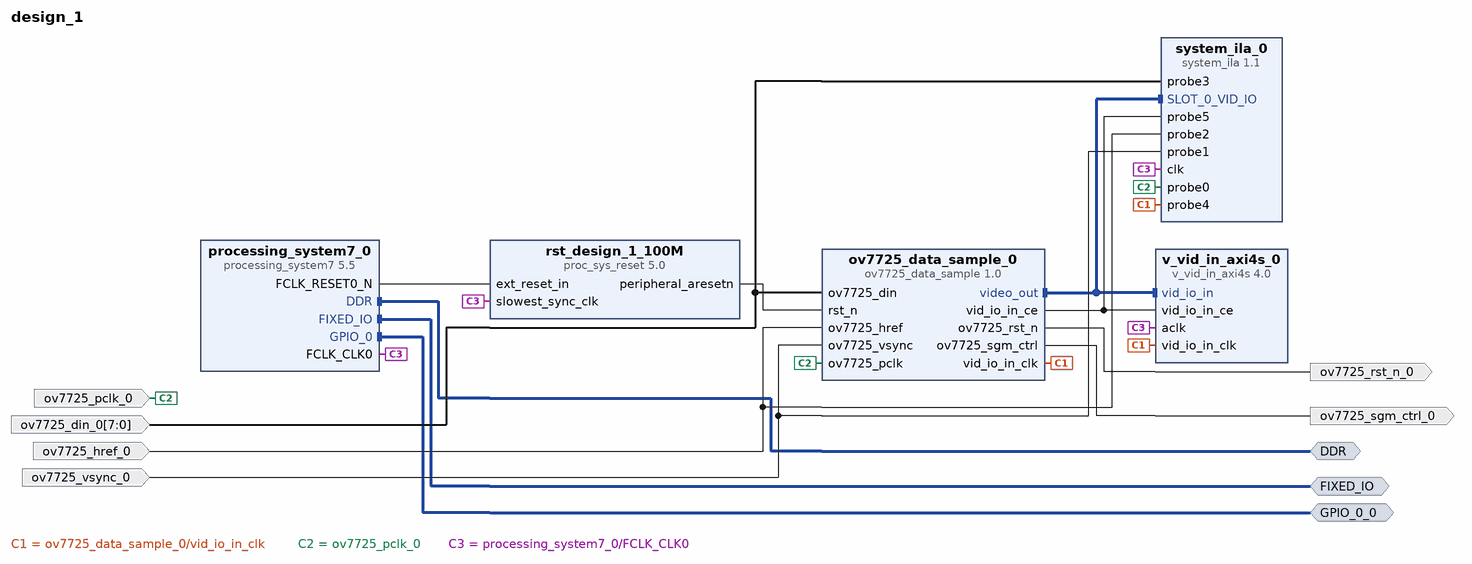
[diagram p0: block diagram of the top level]
# Vivado block design design_1, xc7z010clg400-1, Vivado 2021.1
create_bd_design design_1

create_bd_intf_port -mode Master -vlnv xilinx.com:interface:ddrx_rtl:1.0 DDR
create_bd_intf_port -mode Master -vlnv xilinx.com:display_processing_system7:fixedio_rtl:1.0 FIXED_IO
create_bd_intf_port -mode Master -vlnv xilinx.com:interface:gpio_rtl:1.0 GPIO_0_0
create_bd_port -dir I -type clk ov7725_pclk_0
create_bd_port -dir I ov7725_vsync_0
create_bd_port -dir I -from 7 -to 0 ov7725_din_0
create_bd_port -dir I ov7725_href_0
create_bd_port -dir O -type rst ov7725_rst_n_0
create_bd_port -dir O ov7725_sgm_ctrl_0

create_bd_cell -type ip -vlnv xilinx.com:ip:processing_system7:5.5 processing_system7_0
set_property -dict [list \
  CONFIG.PCW_FCLK_CLK0_BUF FALSE \
  CONFIG.PCW_FPGA0_PERIPHERAL_FREQMHZ 24 \
  CONFIG.PCW_GPIO_EMIO_GPIO_ENABLE 1 \
  CONFIG.PCW_GPIO_EMIO_GPIO_IO 8 \
  CONFIG.PCW_GPIO_EMIO_GPIO_WIDTH 8 \
  CONFIG.PCW_GPIO_MIO_GPIO_ENABLE 1 \
  CONFIG.PCW_GPIO_MIO_GPIO_IO MIO \
  CONFIG.PCW_I2C_RESET_ENABLE 1 \
  CONFIG.PCW_PRESET_BANK1_VOLTAGE {LVCMOS 1.8V} \
  CONFIG.PCW_UART1_PERIPHERAL_ENABLE 1 \
  CONFIG.PCW_UART1_UART1_IO {MIO 48 .. 49} \
  CONFIG.PCW_UART_PERIPHERAL_FREQMHZ 100 \
  CONFIG.PCW_UIPARAM_DDR_BUS_WIDTH {16 Bit} \
  CONFIG.PCW_UIPARAM_DDR_PARTNO {MT41J256M16 RE-125} \
  CONFIG.PCW_USB_RESET_ENABLE 1 \
  CONFIG.PCW_USE_M_AXI_GP0 0 \
] [get_bd_cells processing_system7_0]
# 196 more settings of processing_system7_0 are not shown: defaults, MIO pin electricals, DDR timing, and values the tool derives
create_bd_cell -type ip -vlnv xilinx.com:user:ov7725_data_sample:1.0 ov7725_data_sample_0
create_bd_cell -type ip -vlnv xilinx.com:ip:proc_sys_reset:5.0 rst_design_1_100M
create_bd_cell -type ip -vlnv xilinx.com:ip:v_vid_in_axi4s:4.0 v_vid_in_axi4s_0
set_property -dict {CONFIG.C_HAS_ASYNC_CLK 1} [get_bd_cells v_vid_in_axi4s_0]
create_bd_cell -type ip -vlnv xilinx.com:ip:system_ila:1.1 system_ila_0
set_property -dict [list \
  CONFIG.C_DATA_DEPTH 32768 \
  CONFIG.C_MON_TYPE MIX \
  CONFIG.C_NUM_MONITOR_SLOTS 1 \
  CONFIG.C_NUM_OF_PROBES 6 \
  CONFIG.C_PROBE3_WIDTH 8 \
  CONFIG.C_PROBE_WIDTH_PROPAGATION MANUAL \
  CONFIG.C_SLOT_0_INTF_TYPE xilinx.com:interface:vid_io_rtl:1.0 \
  CONFIG.C_SLOT_0_TYPE 0 \
] [get_bd_cells system_ila_0]

# ---- connections ----

connect_bd_intf_net -intf_net ov7725_data_sample_0_video_out [get_bd_intf_pins ov7725_data_sample_0/video_out] [get_bd_intf_pins v_vid_in_axi4s_0/vid_io_in]
connect_bd_intf_net [get_bd_intf_pins ov7725_data_sample_0/video_out] [get_bd_intf_pins system_ila_0/SLOT_0_VID_IO]
connect_bd_intf_net [get_bd_intf_ports DDR] [get_bd_intf_pins processing_system7_0/DDR]
connect_bd_intf_net [get_bd_intf_ports FIXED_IO] [get_bd_intf_pins processing_system7_0/FIXED_IO]
connect_bd_intf_net [get_bd_intf_ports GPIO_0_0] [get_bd_intf_pins processing_system7_0/GPIO_0]
connect_bd_net [get_bd_pins ov7725_data_sample_0/ov7725_rst_n] [get_bd_ports ov7725_rst_n_0]
connect_bd_net [get_bd_pins ov7725_data_sample_0/ov7725_sgm_ctrl] [get_bd_ports ov7725_sgm_ctrl_0]
connect_bd_net [get_bd_pins ov7725_data_sample_0/vid_io_in_ce] [get_bd_pins v_vid_in_axi4s_0/vid_io_in_ce] [get_bd_pins system_ila_0/probe5]
connect_bd_net [get_bd_pins ov7725_data_sample_0/vid_io_in_clk] [get_bd_pins v_vid_in_axi4s_0/vid_io_in_clk] [get_bd_pins system_ila_0/probe4]
connect_bd_net -net ov7725_din_0_1 [get_bd_ports ov7725_din_0] [get_bd_pins ov7725_data_sample_0/ov7725_din] [get_bd_pins system_ila_0/probe3]
connect_bd_net -net ov7725_href_0_1 [get_bd_ports ov7725_href_0] [get_bd_pins ov7725_data_sample_0/ov7725_href] [get_bd_pins system_ila_0/probe2]
connect_bd_net -net ov7725_pclk_0_1 [get_bd_ports ov7725_pclk_0] [get_bd_pins ov7725_data_sample_0/ov7725_pclk] [get_bd_pins system_ila_0/probe0]
connect_bd_net -net ov7725_vsync_0_1 [get_bd_ports ov7725_vsync_0] [get_bd_pins ov7725_data_sample_0/ov7725_vsync] [get_bd_pins system_ila_0/probe1]
connect_bd_net [get_bd_pins processing_system7_0/FCLK_CLK0] \
  [get_bd_pins rst_design_1_100M/slowest_sync_clk] [get_bd_pins v_vid_in_axi4s_0/aclk] [get_bd_pins system_ila_0/clk]
connect_bd_net [get_bd_pins processing_system7_0/FCLK_RESET0_N] [get_bd_pins rst_design_1_100M/ext_reset_in]
connect_bd_net [get_bd_pins rst_design_1_100M/peripheral_aresetn] [get_bd_pins ov7725_data_sample_0/rst_n]
set_property HDL_ATTRIBUTE.DEBUG true [get_bd_intf_nets ov7725_data_sample_0_video_out]
set_property HDL_ATTRIBUTE.MARK_DEBUG true [get_bd_intf_nets ov7725_data_sample_0_video_out]

validate_bd_design
save_bd_design
